# Altium schematic sheet PMIC_3V3.SchDoc: 3.3V Power Supply
size B; CheckedBy: Jason Sullins; Author: Jordan Harris-Toovy; Revision: 0.2; SheetNumber: 13; SheetTotal: 22; Size: ANSI B
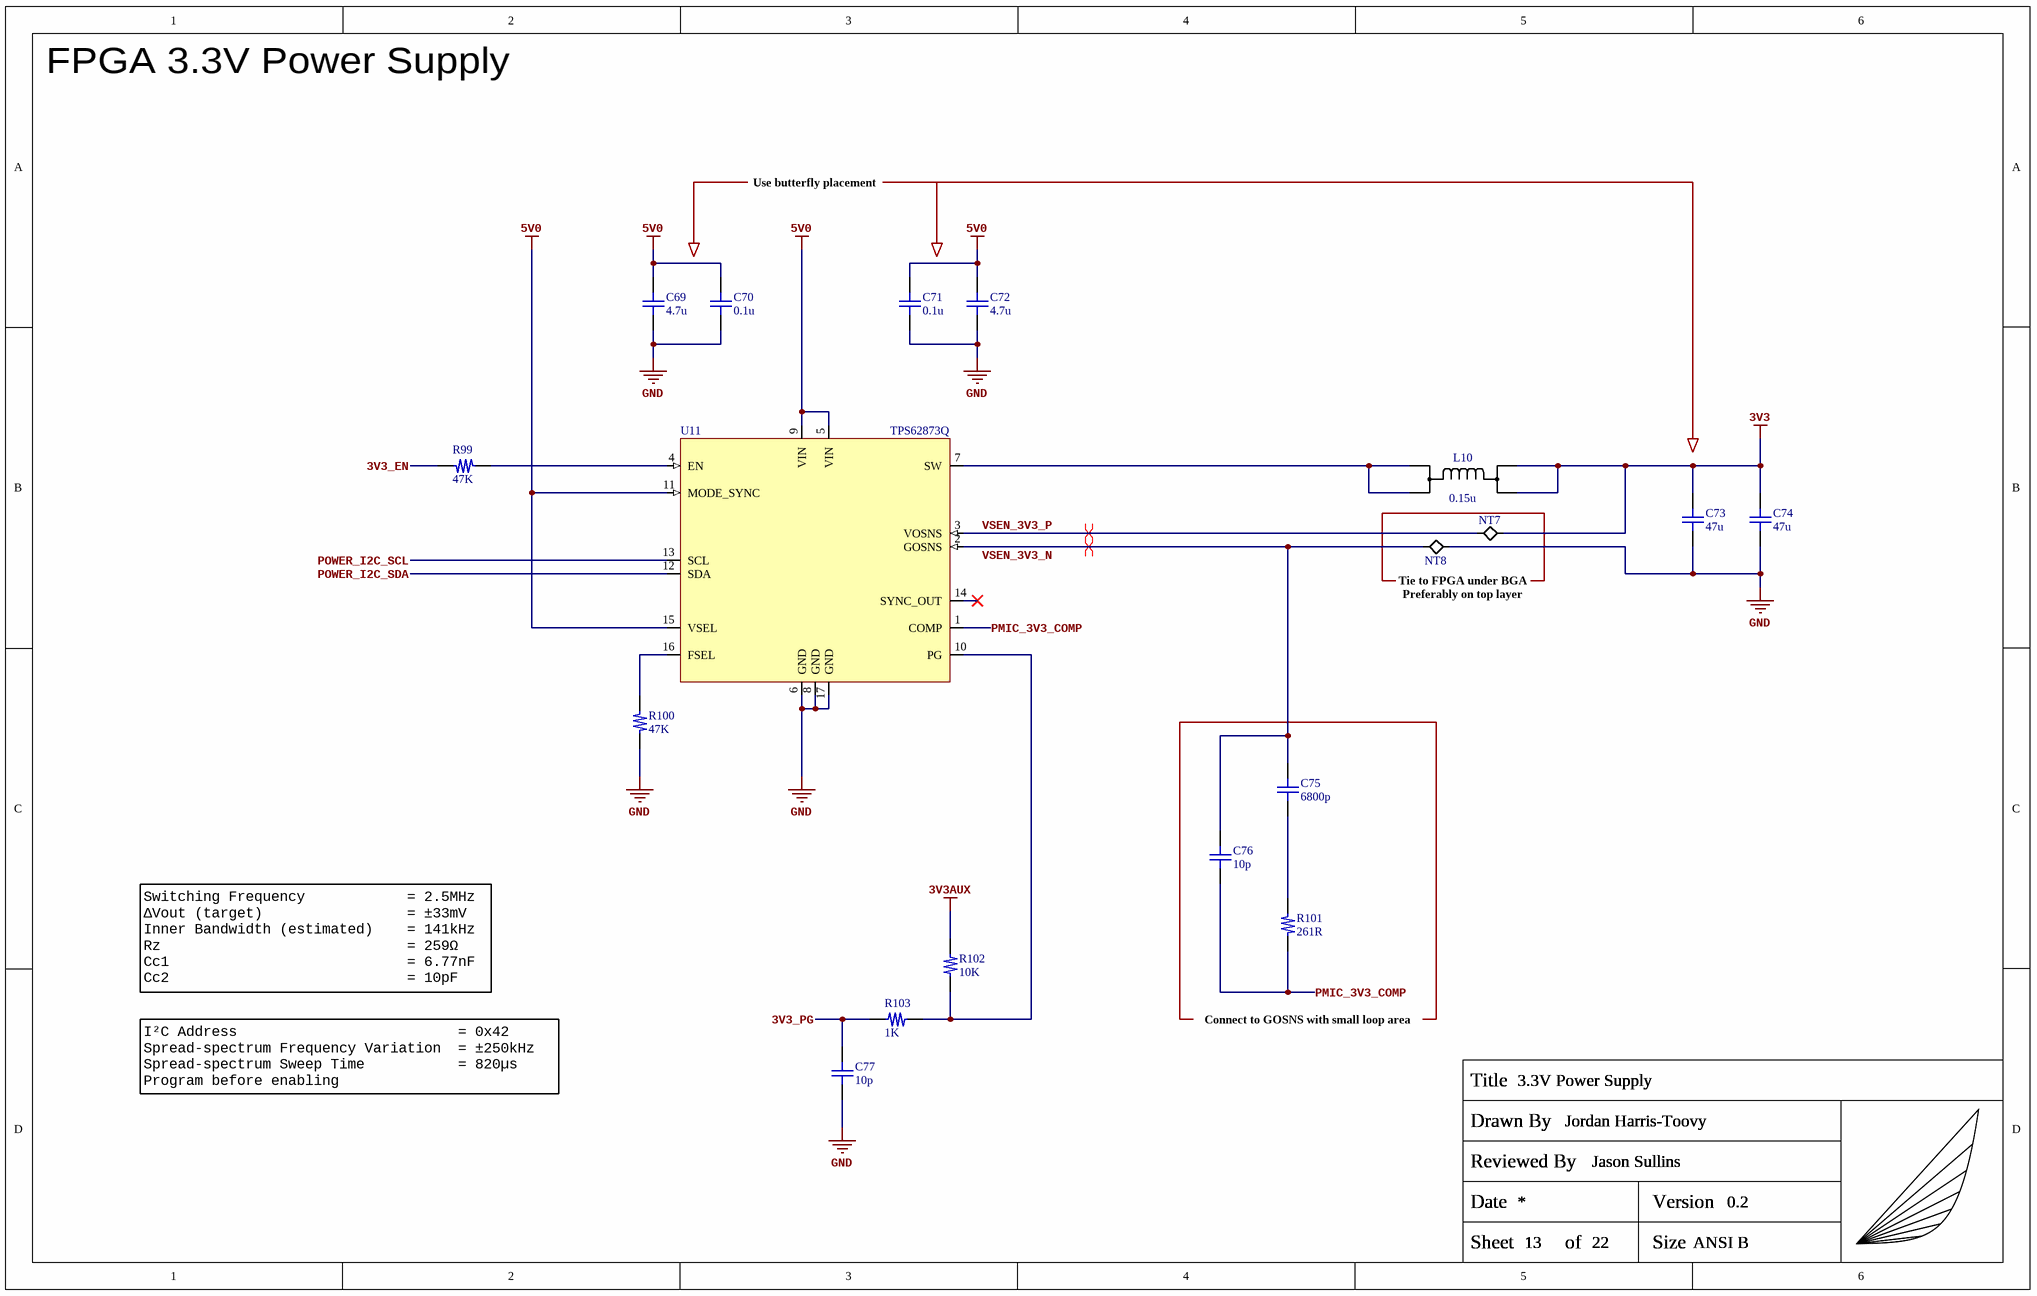
[diagram p0: PMIC_3V3.SchDoc]

## Parts
C69  4.7u  [C_0402_Generic]
C70  0.1u  [C_0402_Generic]
C71  0.1u  [C_0402_Generic]
C72  4.7u  [C_0402_Generic]
C73  47u  [C_0603_Generic]
C74  47u  [C_0603_Generic]
C75  6800p  [C_0402_Generic]
C76  10p  [C_0402_Generic]
C77  10p  [C_0402_Generic]
L10  0.15u  [TDK_CLT32]
NT7  NT  [SMD_NET_TIE]  (value not drawn)  (net tie, no BOM)
NT8  NT  [SMD_NET_TIE]  (value not drawn)  (net tie, no BOM)
R99  47K  [R_0402_Generic]
R100  47K  [R_0402_Generic]
R101  261R  [R_0402_Generic]
R102  10K  [R_0402_Generic]
R103  1K  [R_0402_Generic]
TITLEBLOCK?  Capstone_Title_Block  (value not drawn)  (graphical)
U11  TPS62873Q  [TPS6287x-Q1]

## Nets
3V3: C73.2 C74.2 L10.3(P3) L10.4(P4) NT7.2(P2)
3V3AUX: R102.2
5V0: C69.2 C70.2 C71.2 C72.2 U11.5(VIN) U11.9(VIN) U11.11(MODE_SYNC) U11.15(VSEL)
GND: C69.1 C70.1 C71.1 C72.1 C73.1 C74.1 C77.1 NT8.2(P2) R100.1 U11.6(GND) U11.8(GND) U11.17(GND)
3V3_EN: R99.2
3V3_PG: C77.2 R103.1
PMIC_3V3_COMP: C76.1 R101.1 U11.1(COMP)
POWER_I2C_SCL: U11.13(SCL)
POWER_I2C_SDA: U11.12(SDA)
VSEN_3V3_N: C75.2 C76.2 NT8.1(P1) U11.2(GOSNS)
VSEN_3V3_P: NT7.1(P1) U11.3(VOSNS)
NetC75_1: C75.1 R101.2
NetL10_1: L10.1(P1) L10.2(P2) U11.7(SW)
NetR99_1: R99.1 U11.4(EN)
NetR100_2: R100.2 U11.16(FSEL)
NetR102_1: R102.1 R103.2 U11.10(PG)

Not connected (* = marked no-connect by the designer): U11 14(SYNC_OUT)*

## Layout directives
differential pair; differential pair class DP_PMIC_SENSE: VSEN_3V3_N, VSEN_3V3_P

## Notes on the sheet
- FPGA 3.3V Power Supply
- Use butterfly placement
- Tie to FPGA under BGA
- Preferably on top layer
- Switching Frequency            = 2.5MHz
  ΔVout (target)                 = ±33mV
  Inner Bandwidth (estimated)    = 141kHz
  Rz                             = 259Ω
  Cc1                            = 6.77nF
  Cc2                            = 10pF
- Connect to GOSNS with small loop area
- I²C Address                          = 0x42
  Spread-spectrum Frequency Variation  = ±250kHz
  Spread-spectrum Sweep Time           = 820µs
  Program before enabling
- (in symbol Capstone_Title_Block) Title; Drawn By; Reviewed By; Date; Version; Sheet; of; Size

## Library data of the parts
C69 C72 = GRM155R61A475MEAAJ: 4.7µF 10V X5R SMD ceramic capacitor in 0402 size; Manufacturer: Murata Electronics; Manufacturer Part Number: GRM155R61A475MEAAJ
C70 C71 = GRM155R71C104KA88D: 0.1µF 16V X7R SMD ceramic capacitor in 0402 size; Manufacturer: Murata Electronics; Manufacturer Part Number: GRM155R71C104KA88D
C73 C74 = GRM188R60J476ME15D: 47µF 6.3V X5R SMD ceramic capacitor in 0603 size; Manufacturer: Murata Electronics; Manufacturer Part Number: GRM188R60J476ME15D
C75 = GRM155R71E682KA01D: 6800pF 25V X7R SMD ceramic capacitor in 0402 size; Manufacturer: Murata Electronics; Manufacturer Part Number: GRM155R71E682KA01D
C76 C77 = GRM1555C1H100JA01D: 10pF 50V C0G/NP0 SMD ceramic capacitor in 0402 size; Manufacturer: Murata Electronics; Manufacturer Part Number: GRM1555C1H100JA01D
L10 = CLT3217N: Inductor 150nH 3.3mOhm 25.4A AEC-Q200, TDK; Manufacturer: EPCOS/TDK; Manufacturer Part Number: CLT32-17N
NT7 NT8 = Net_Tie_SMD: SMD Net Tie; Manufacturer: NONE; Manufacturer Part Number: NONE
R99 R100 = ERJ-2RKF4702X: 47KOhm 1% 1/10W SMD resistor in 0402 size; Manufacturer: Panasonic; Manufacturer Part Number: ERJ-2RKF4702X
R101 = ERJ-2RKF2610X: 261Ohm 1% 1/10W SMD resistor in 0402 size; Manufacturer: Panasonic; Manufacturer Part Number: ERJ-2RKF2610X
R102 = ERJ-2RKF1002X: 10KOhm 1% 1/10W SMD resistor in 0402 size; Manufacturer: Panasonic; Manufacturer Part Number: ERJ-2RKF1002X
R103 = ERJ-2RKF1001X: 1KOhm 1% 1/10W SMD resistor in 0402 size; Manufacturer: Panasonic; Manufacturer Part Number: ERJ-2RKF1001X
TITLEBLOCK? = Capstone_Title_Block: Custom title block with personal logo; Manufacturer: NONE; Manufacturer Part Number: NONE
U11 = TPS62873QWRXSRQ1: Switching Voltage Regulators Automotive 2.7-V to 6-V input, 15-A, stackable, synchronous buck converter 16-VQFN-FCRLF -40 to 125C; Manufacturer: Texas Instruments; Manufacturer Part Number: TPS62873QWRXSRQ1